# Altium schematic sheet Laser_main.SchDoc: Main
size A4; SheetNumber: 1; SheetTotal: 4
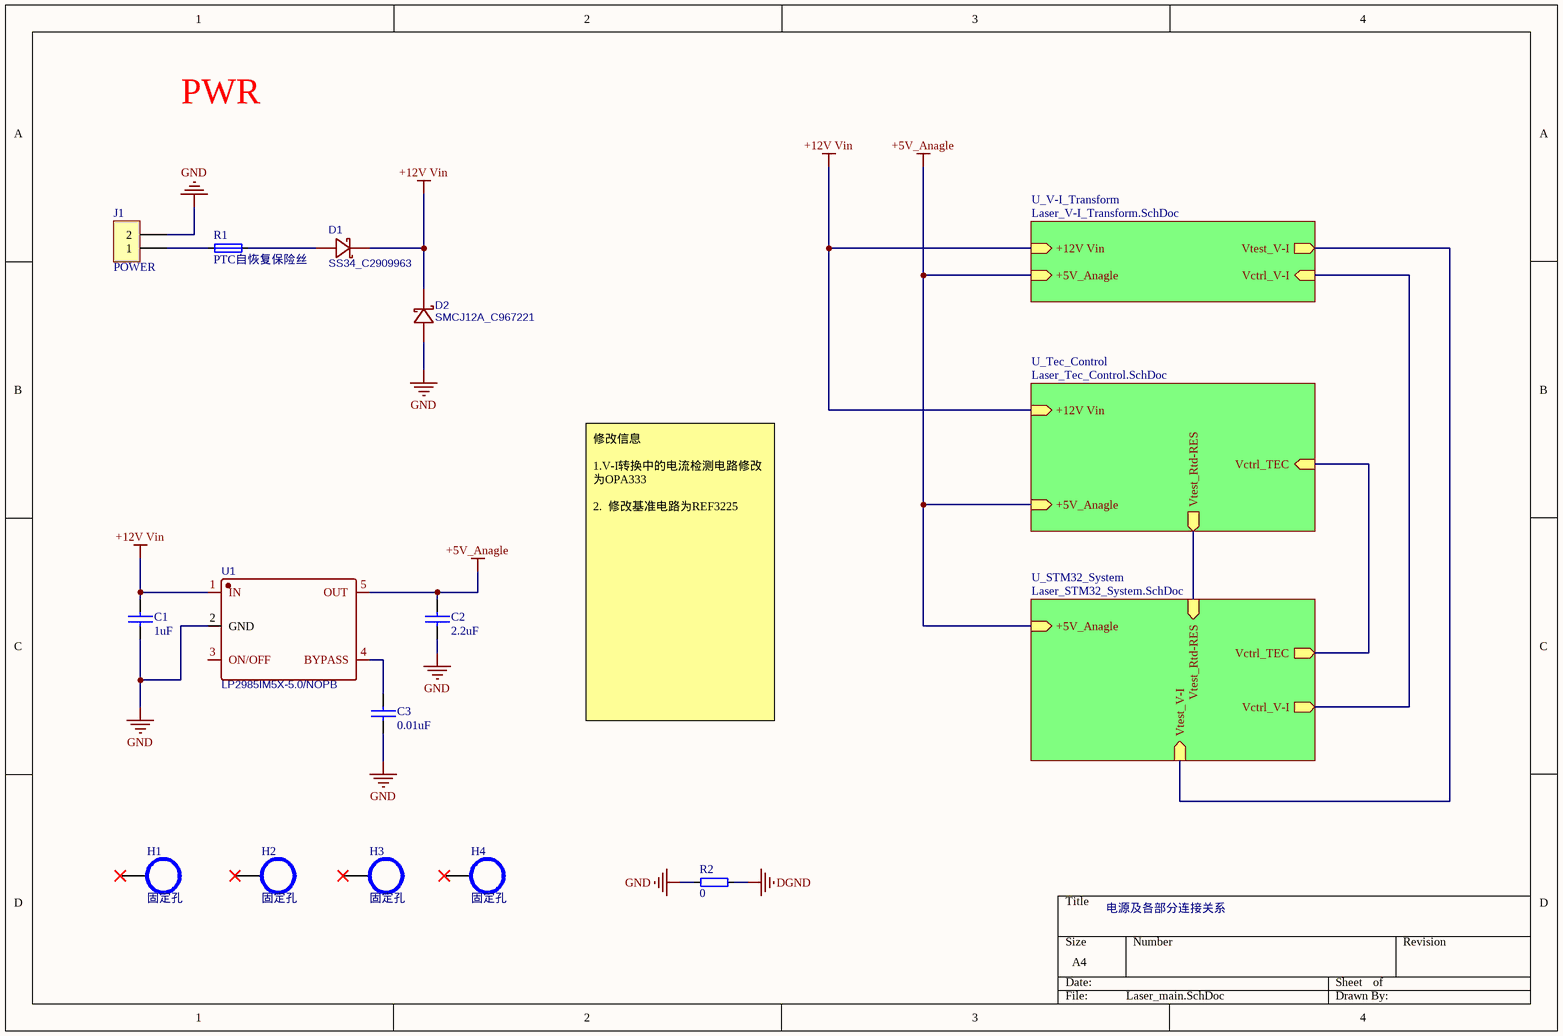
[diagram p0: Laser_main.SchDoc]

## Parts
C1  1uF  [C 0603_M]
C2  2.2uF  [C 0603_M]
C3  0.01uF  [C 0603_M]
D1  SS34_C2909963  [SMA_L4.2-W2.7-LS5.0-RD]
D2  SMCJ12A_C967221  [SMC_L6.9-W5.9-LS8.0-RD]
H1  固定孔  [铜柱孔3]
H2  固定孔  [铜柱孔3]
H3  固定孔  [铜柱孔3]
H4  固定孔  [铜柱孔3]
J1  POWER  [KF128-5.08-2P]
R1  PTC自恢复保险丝  [0805R]
R2  0  [0603R]
U1  LP2985IM5X-5.0/NOPB  [SOT-23-5_L3.0-W1.7-P0.95-LS2.8-BR]

## Sub-sheets
U_STM32_System = Laser_STM32_System.SchDoc: +5V_Anagle (in), Vtest_Rtd-RES (in), Vtest_V-I (in), Vctrl_V-I (out), Vctrl_TEC (out)
U_Tec_Control = Laser_Tec_Control.SchDoc: +12V Vin (in), +5V_Anagle (in), Vctrl_TEC (in), Vtest_Rtd-RES (out)
U_V-I_Transform = Laser_V-I_Transform.SchDoc: Vctrl_V-I (in), Vtest_V-I (out), +5V_Anagle (in), +12V Vin (in)

## Nets
+5V_Anagle: C2.1 U1.5(OUT) ; sheet U_V-I_Transform/+5V_Anagle, sheet U_Tec_Control/+5V_Anagle, sheet U_STM32_System/+5V_Anagle
+12V Vin: C1.1 D1.1 D2.1(C) U1.1(IN) ; sheet U_V-I_Transform/+12V Vin, sheet U_Tec_Control/+12V Vin
DGND: R2.1
GND: C1.2 C2.2 C3.2 D2.2(A) J1.2 R2.2 U1.2(GND)
NetC3_1: C3.1 U1.4(BYPASS)
NetD1_2: D1.2 R1.2
NetJ1_1: J1.1 R1.1
(unnamed): sheet U_V-I_Transform/Vctrl_V-I, sheet U_STM32_System/Vctrl_V-I
(unnamed): sheet U_V-I_Transform/Vtest_V-I, sheet U_STM32_System/Vtest_V-I
(unnamed): sheet U_Tec_Control/Vctrl_TEC, sheet U_STM32_System/Vctrl_TEC
(unnamed): sheet U_Tec_Control/Vtest_Rtd-RES, sheet U_STM32_System/Vtest_Rtd-RES

Not connected (* = marked no-connect by the designer): H1 11*; H2 11*; H3 11*; H4 11*; U1 3(ON/OFF)

## Notes on the sheet
- PWR
- 修改信息
  1.V-I转换中的电流检测电路修改为OPA333
  2.  修改基准电路为REF3225
- 电源及各部分连接关系

## Library data of the parts
C1-C3 = 普通电容: Capacitor
D1 = SS34_C2909963: BOM_Manufacturer: YONGYUTAI(永裕泰); BOM_Manufacturer Part: SS34; Contributor: LCSC; BOM_Supplier: LCSC; BOM_Supplier Part: C2909963; BOM_JLCPCB Part Class: Extended Part; spicePre: D; spiceSymbolName: SS34_C2909963
D2 = SMCJ12A_C967221: BOM_Manufacturer: Boarden(宝宫); Contributor: LCSC; BOM_Supplier: LCSC; BOM_Supplier Part: C967221; BOM_Manufacturer Part: SMCJ12A; spicePre: D; spiceSymbolName: SMCJ12A_C967221
J1 = SIP2: jointbar
R2 = 普通电阻: 电阻精度为0.1%
U1 = LP2985IM5X-5.0/NOPB: BOM_Manufacturer: Texas Instruments; Contributor: LCSC; BOM_Supplier: LCSC; BOM_Supplier Part: C73908; BOM_Manufacturer Part: LP2985IM5X-5.0/NOPB; BOM_JLCPCB Part Class: Extended Part; spicePre: U; spiceSymbolName: LP2985IM5X-5.0/NOPB